# EAGLE design Wozblaster_v1.2 (EAGLE 6.5.0)
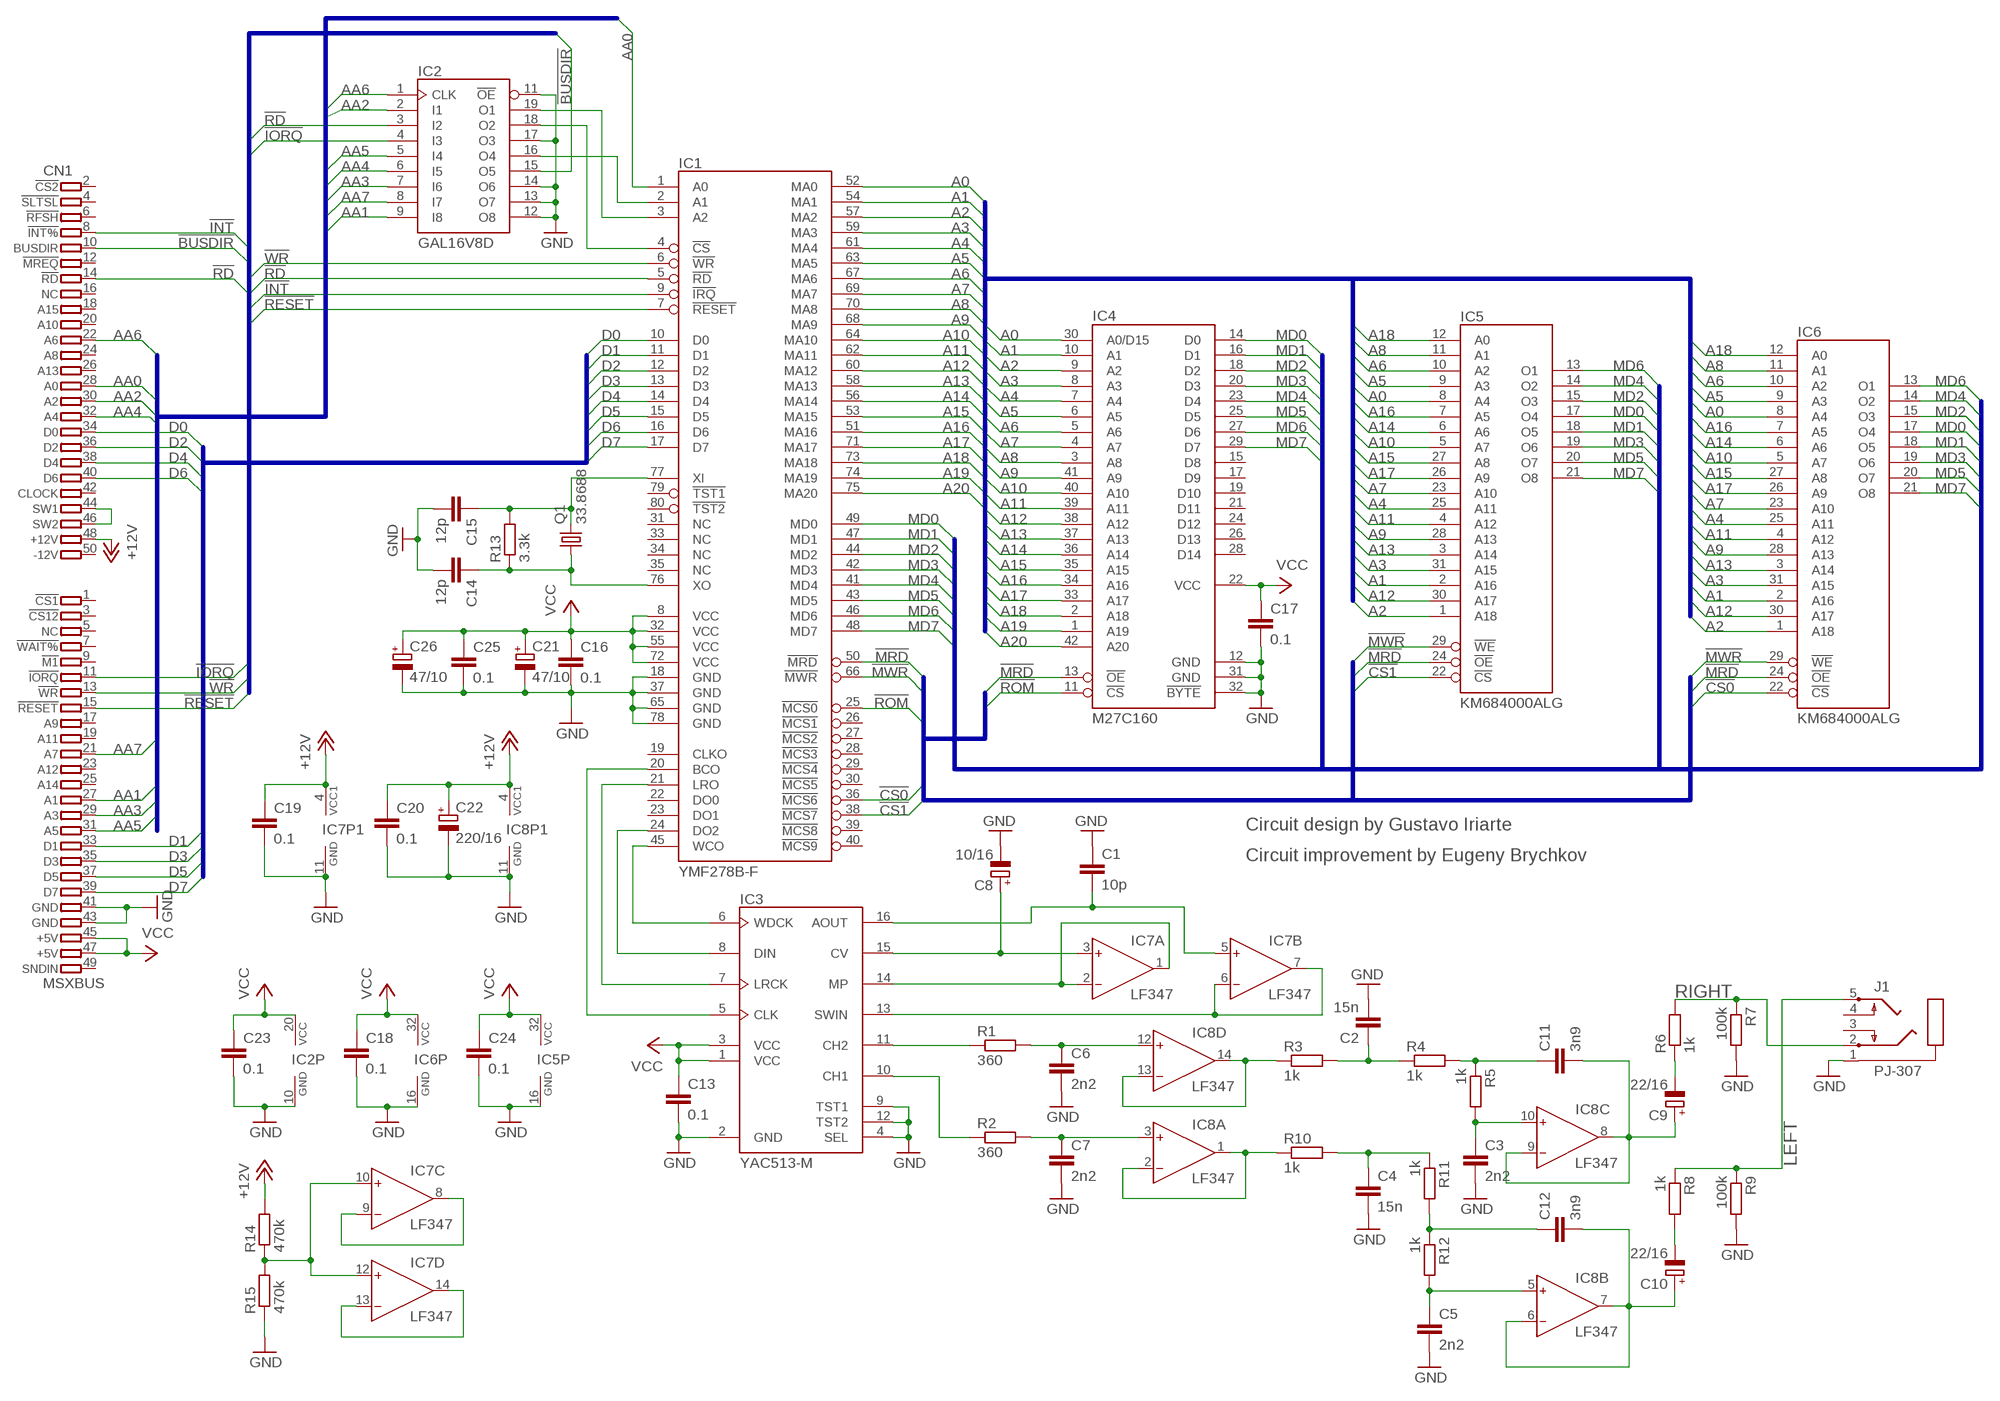
[diagram p0: schematic, sheet 1]

## Parts
C1  10p  C-EU  [C0805]
C2  15n  C-EU  [C0805]
C3  2n2  C-EU  [C0805]
C4  15n  C-EU  [C0805]
C5  2n2  C-EU  [C0805]
C6  2n2  C-EU  [C0805]
C7  2n2  C-EU  [C0805]
C8  10/16  CPOLSMCB  [SMC_B]
C9  22/16  CPOLSMCB  [SMC_B]
C10  22/16  CPOLSMCB  [SMC_B]
C11  3n9  C-EU  [C0805]
C12  3n9  C-EU  [C0805]
C13  0.1  C-EU  [C0805]
C14  12p  C-EU  [C0805]
C15  12p  C-EU  [C0805]
C16  0.1  C-EU  [C0805]
C17  0.1  C-EU  [C0805]
C18  0.1  C-EU  [C0805]
C19  0.1  C-EU  [C0805]
C20  0.1  C-EU  [C0805]
C21  47/10  CPOLSMCB  [SMC_B]
C22  220/16  CPOLSMCE  [SMC_E]
C23  0.1  C-EU  [C0805]
C24  0.1  C-EU  [C0805]
C25  0.1  C-EU  [C0805]
C26  47/10  CPOLSMCB  [SMC_B]
CN1  MSXBUS  MSXBUS_EDGE  [MSXBUS_EDGECONN]
IC1  YMF278B-F  [80-QFP]
IC2  GAL16V8D  GAL16V8P3  [DIL20]
IC3  YAC513-M  [16SOP]
IC4  M27C160  [DIL42]
IC5  KM684000ALG  SRAM4MBIT  [SOP32L]
IC6  KM684000ALG  SRAM4MBIT  [SOP32L]
IC7  LF347  LF347SO14  [SO14-2]
IC8  LF347  LF347SO14  [SO14-2]
J1  PJ-307  [PJ-307]
Q1  33.8688  CRYSTALHC49S  [HC49/S]
R1  360  R-EU  [R0805]
R2  360  R-EU  [R0805]
R3  1k  R-EU  [R0805]
R4  1k  R-EU  [R0805]
R5  1k  R-EU  [R0805]
R6  1k  R-EU  [R0805]
R7  100k  R-EU  [R0805]
R8  1k  R-EU  [R0805]
R9  100k  R-EU  [R0805]
R10  1k  R-EU  [R0805]
R11  1k  R-EU  [R0805]
R12  1k  R-EU  [R0805]
R13  3.3k  R-EU  [R0805]
R14  470k  R-EU  [R0805]
R15  470k  R-EU  [R0805]

## Nets
!BUSDIR: CN1.10(10.BUSDIR) IC2.15(O5)
!CS0: IC1.36(!MCS6) IC6.22(!CS)
!CS1: IC1.38(!MCS7) IC5.22(!CS)
!INT: CN1.8(8.!INT%) IC1.9(!IRQ)
!IORQ: CN1.11(11.!IORQ) IC2.4(I3)
!MRD: IC1.50(!MRD) IC4.13(!OE) IC5.24(!OE) IC6.24(!OE)
!MWR: IC1.66(!MWR) IC5.29(!WE) IC6.29(!WE)
!RD: CN1.14(14.!RD) IC1.5(!RD) IC2.3(I2)
!RESET: CN1.15(15.!RESET) IC1.7(!RESET)
!ROM: IC1.25(!MCS0) IC4.11(!CS)
!WR: CN1.13(13.!WR) IC1.6(!WR)
+12V: C19.1 C20.1 C22.+ CN1.48(48.+12V) IC7.4(P1:VCC) IC8.4(P1:VCC) R14.2
A0: IC1.52(MA0) IC4.30(A0/D15) IC5.8(A4) IC6.8(A4)
A1: IC1.54(MA1) IC4.10(A1) IC5.2(A16) IC6.2(A16)
A2: IC1.57(MA2) IC4.9(A2) IC5.1(A18) IC6.1(A18)
A3: IC1.59(MA3) IC4.8(A3) IC5.31(A15) IC6.31(A15)
A4: IC1.61(MA4) IC4.7(A4) IC5.25(A11) IC6.25(A11)
A5: IC1.63(MA5) IC4.6(A5) IC5.9(A3) IC6.9(A3)
A6: IC1.67(MA6) IC4.5(A6) IC5.10(A2) IC6.10(A2)
A7: IC1.69(MA7) IC4.4(A7) IC5.23(A10) IC6.23(A10)
A8: IC1.70(MA8) IC4.3(A8) IC5.11(A1) IC6.11(A1)
A9: IC1.68(MA9) IC4.41(A9) IC5.28(A13) IC6.28(A13)
A10: IC1.64(MA10) IC4.40(A10) IC5.5(A7) IC6.5(A7)
A11: IC1.62(MA11) IC4.39(A11) IC5.4(A12) IC6.4(A12)
A12: IC1.60(MA12) IC4.38(A12) IC5.30(A17) IC6.30(A17)
A13: IC1.58(MA13) IC4.37(A13) IC5.3(A14) IC6.3(A14)
A14: IC1.56(MA14) IC4.36(A14) IC5.6(A6) IC6.6(A6)
A15: IC1.53(MA15) IC4.35(A15) IC5.27(A8) IC6.27(A8)
A16: IC1.51(MA16) IC4.34(A16) IC5.7(A5) IC6.7(A5)
A17: IC1.71(MA17) IC4.33(A17) IC5.26(A9) IC6.26(A9)
A18: IC1.73(MA18) IC4.2(A18) IC5.12(A0) IC6.12(A0)
A19: IC1.74(MA19) IC4.1(A19)
A20: IC1.75(MA20) IC4.42(A20)
AA0: CN1.28(28.A0) IC1.1(A0)
AA1: CN1.27(27.A1) IC2.9(I8)
AA2: CN1.30(30.A2) IC2.2(I1)
AA3: CN1.29(29.A3) IC2.7(I6)
AA4: CN1.32(32.A4) IC2.6(I5)
AA5: CN1.31(31.A5) IC2.5(I4)
AA6: CN1.22(22.A6) IC2.1(CLK)
AA7: CN1.21(21.A7) IC2.8(I7)
D0: CN1.34(34.D0) IC1.10(D0)
D1: CN1.33(33.D1) IC1.11(D1)
D2: CN1.36(36.D2) IC1.12(D2)
D3: CN1.35(35.D3) IC1.13(D3)
D4: CN1.38(38.D4) IC1.14(D4)
D5: CN1.37(37.D5) IC1.15(D5)
D6: CN1.40(40.D6) IC1.16(D6)
D7: CN1.39(39.D7) IC1.17(D7)
GND: C1.1 C2.2 C3.2 C4.2 C5.2 C6.2 C7.2 C8.- C13.2 C14.2 C15.2 C16.2 C17.2 C18.2 C19.2 C20.2 C21.- C22.- C23.2 C24.2 C25.2 C26.- CN1.41(41.GND) CN1.43(43.GND) IC1.18(GND) IC1.37(GND) IC1.65(GND) IC1.78(GND) IC2.10(GND) IC2.11(!OE) IC2.12(O8) IC2.13(O7) IC2.14(O6) IC2.17(O3) IC3.2(GND) IC3.4(SEL) IC3.9(TST1) IC3.12(TST2) IC4.12(GND) IC4.31(GND) IC4.32(!BYTE) IC5.16(GND) IC6.16(GND) IC7.11(P1:GND) IC8.11(P1:GND) J1.1 R7.2 R9.2 R15.1
MD0: IC1.49(MD0) IC4.14(D0) IC5.17(O4) IC6.17(O4)
MD1: IC1.47(MD1) IC4.16(D1) IC5.18(O5) IC6.18(O5)
MD2: IC1.44(MD2) IC4.18(D2) IC5.15(O3) IC6.15(O3)
MD3: IC1.42(MD3) IC4.20(D3) IC5.19(O6) IC6.19(O6)
MD4: IC1.41(MD4) IC4.23(D4) IC5.14(O2) IC6.14(O2)
MD5: IC1.43(MD5) IC4.25(D5) IC5.20(O7) IC6.20(O7)
MD6: IC1.46(MD6) IC4.27(D6) IC5.13(O1) IC6.13(O1)
MD7: IC1.48(MD7) IC4.29(D7) IC5.21(O8) IC6.21(O8)
N$2: C5.1 IC8.5(B:IN+) R12.2
N$4: CN1.44(44.SW1) CN1.46(46.SW2)
N$5: IC7.10(C:IN+) IC7.12(D:IN+) R14.1 R15.2
N$6: IC7.8(C:OUT) IC7.9(C:IN-)
N$7: IC7.13(D:IN-) IC7.14(D:OUT)
N$11: IC1.3(A2) IC2.19(O1)
N$12: IC1.4(!CS) IC2.18(O2)
N$13: IC1.2(A1) IC2.16(O4)
N$15: C1.2 IC3.16(AOUT) IC7.5(B:IN+)
N$16: IC3.14(MP) IC7.1(A:OUT) IC7.2(A:IN-)
N$17: IC3.11(CH2) R1.1
N$18: C6.1 IC8.12(D:IN+) R1.2
N$19: IC8.13(D:IN-) IC8.14(D:OUT) R3.1
N$20: C2.1 R3.2 R4.1
N$21: C11.1 R4.2 R5.1
N$22: C3.1 IC8.10(C:IN+) R5.2
N$23: C9.+ C11.2 IC8.8(C:OUT) IC8.9(C:IN-)
N$24: C10.- R8.2
N$25: J1.2 R6.2 R7.1
N$26: C7.1 IC8.3(A:IN+) R2.2
N$27: IC8.1(A:OUT) IC8.2(A:IN-) R10.1
N$28: C4.1 R10.2 R11.1
N$29: C12.1 R11.2 R12.1
N$31: C10.+ C12.2 IC8.6(B:IN-) IC8.7(B:OUT)
N$32: C9.- R6.1
N$33: J1.5 R8.1 R9.1
N$34: IC3.10(CH1) R2.1
N$35: C8.+ IC3.15(CV) IC7.3(A:IN+)
N$36: IC3.13(SWIN) IC7.6(B:IN-) IC7.7(B:OUT)
N$37: IC1.20(BCO) IC3.5(CLK)
N$38: IC1.45(WCO) IC3.6(WDCK)
N$39: IC1.21(LRO) IC3.7(LRCK)
N$40: IC1.24(DO2) IC3.8(DIN)
N$41: C15.1 IC1.77(XI) Q1.2 R13.2
N$42: C14.1 IC1.76(XO) Q1.1 R13.1
VCC: C13.1 C16.1 C17.1 C18.1 C21.+ C23.1 C24.1 C25.1 C26.+ CN1.45(45.+5V) CN1.47(47.+5V) IC1.8(VCC) IC1.32(VCC) IC1.55(VCC) IC1.72(VCC) IC2.20(VCC) IC3.1(VCC) IC3.3(VCC) IC4.22(VCC) IC5.32(VCC) IC6.32(VCC)
Unconnected: CN1.1(1.!CS1) CN1.2(2.!CS2) CN1.3(3.!CS12) CN1.4(4.!SLTSL) CN1.5(5.NC) CN1.6(6.!RFSH) CN1.7(7.!WAIT%) CN1.9(9.!M1) CN1.12(12.!MREQ) CN1.16(16.NC) CN1.17(17.A9) CN1.18(18.A15) CN1.19(19.A11) CN1.20(20.A10) CN1.23(23.A12) CN1.24(24.A8) CN1.25(25.A14) CN1.26(26.A13) CN1.42(42.CLOCK) CN1.49(49.SNDIN) CN1.50(50.-12V) IC1.19(CLKO) IC1.22(DO0) IC1.23(DO1) IC1.26(!MCS1) IC1.27(!MCS2) IC1.28(!MCS3) IC1.29(!MCS4) IC1.30(!MCS5) IC1.31(NC) IC1.33(NC) IC1.34(NC) IC1.35(NC) IC1.39(!MCS8) IC1.40(!MCS9) IC1.79(!TST1) IC1.80(!TST2) IC4.15(D8) IC4.17(D9) IC4.19(D10) IC4.21(D11) IC4.24(D12) IC4.26(D13) IC4.28(D14) J1.3 J1.4

## Buses
A[0..20]
MD[0..7]
AA[0..15]
D[0..7]
!IORQ,!RD,!WR,!RESET,!INT,!BUSDIR
!MRD,!MWR,!ROM,!CS0,!CS1

## Notes on the sheet
- Circuit design by Gustavo Iriarte
- Circuit improvement by Eugeny Brychkov
- RIGHT
- LEFT

## Library data of the parts
C1-C7 C11-C20 C23-C25 = wozblaster:C-EU: Capacitor, SMD
C8-C10 C21 C22 C26 = wozblaster:CPOL: Capacitor, polarized, tantalum
CN1 = msx_breadboards:MSXBUS_EDGE: MSX bus (50 pin) edge connector Created 2013 by Eugeny Brychkov
IC1 = wozblaster:YMF278B-F: OPL4 Amended by Eugeny Brychkov
IC2 = wozblaster:GAL16V8: High perfomance CMOS (electrically erasable) programmable logic device (PLD) GAL16V8/ATF16V8B
IC3 = wozblaster:YAC513-M: YAC513 2-channel floating D/A converter
IC4 = wozblaster:M27C160: Dual In Line
IC5 IC6 = wozblaster:SRAM4MBIT: SRAM 4 Mbit Designed by Gustavo Iriarte Compiled by Eugeny Brychkov
IC7 IC8 = wozblaster:LF347SO14: LF347 JFET input quad operational amplifiers
J1 = wozblaster:PJ-307: 2.5mm jack to connect headphones to
Q1 = crystal:CRYSTAL: CRYSTAL; OC_FARNELL: 1667008; OC_NEWARK: unknown
R1-R15 = wozblaster:R-EU: Resistor, SMD

## Board
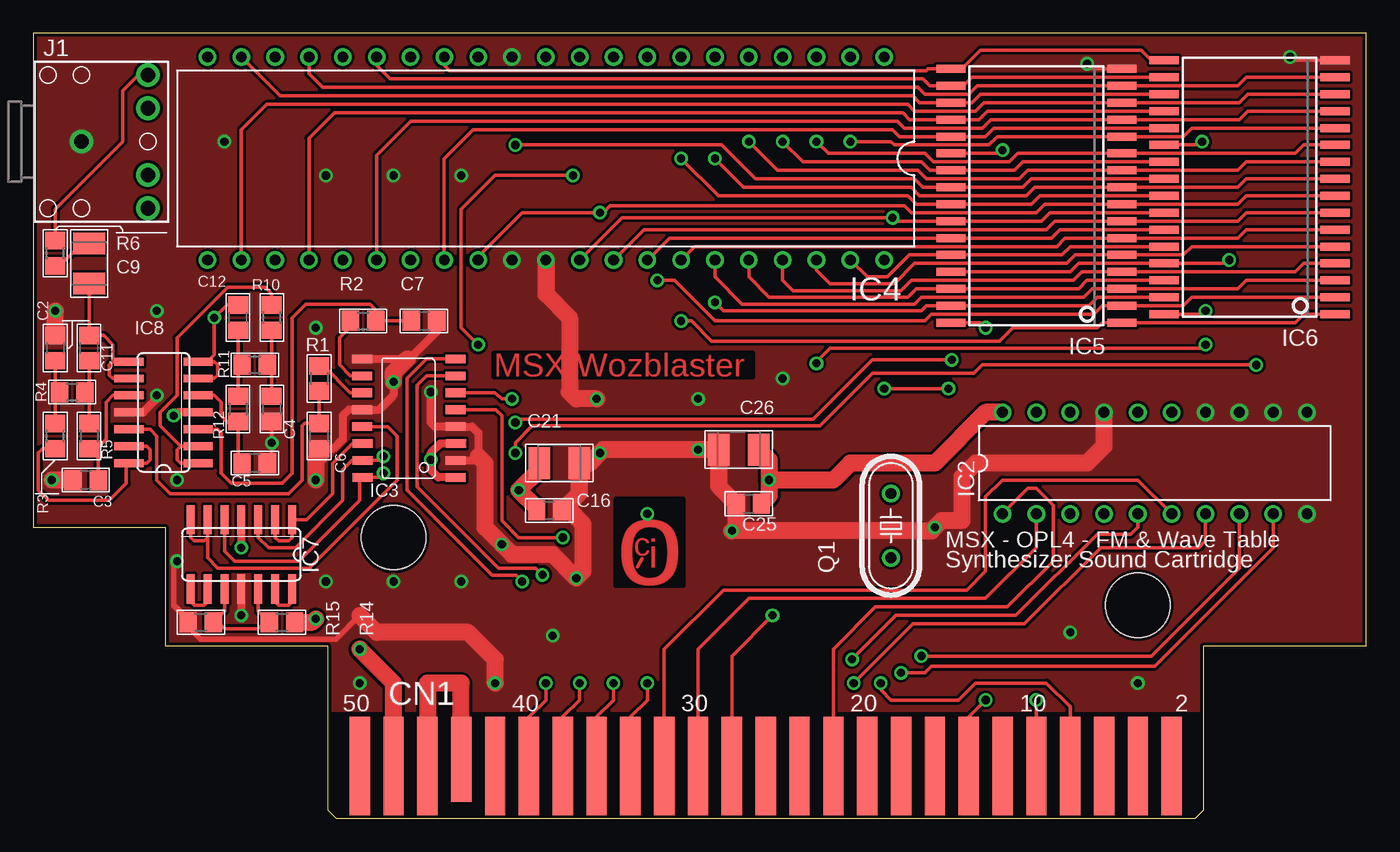
[diagram p1: board, top side]
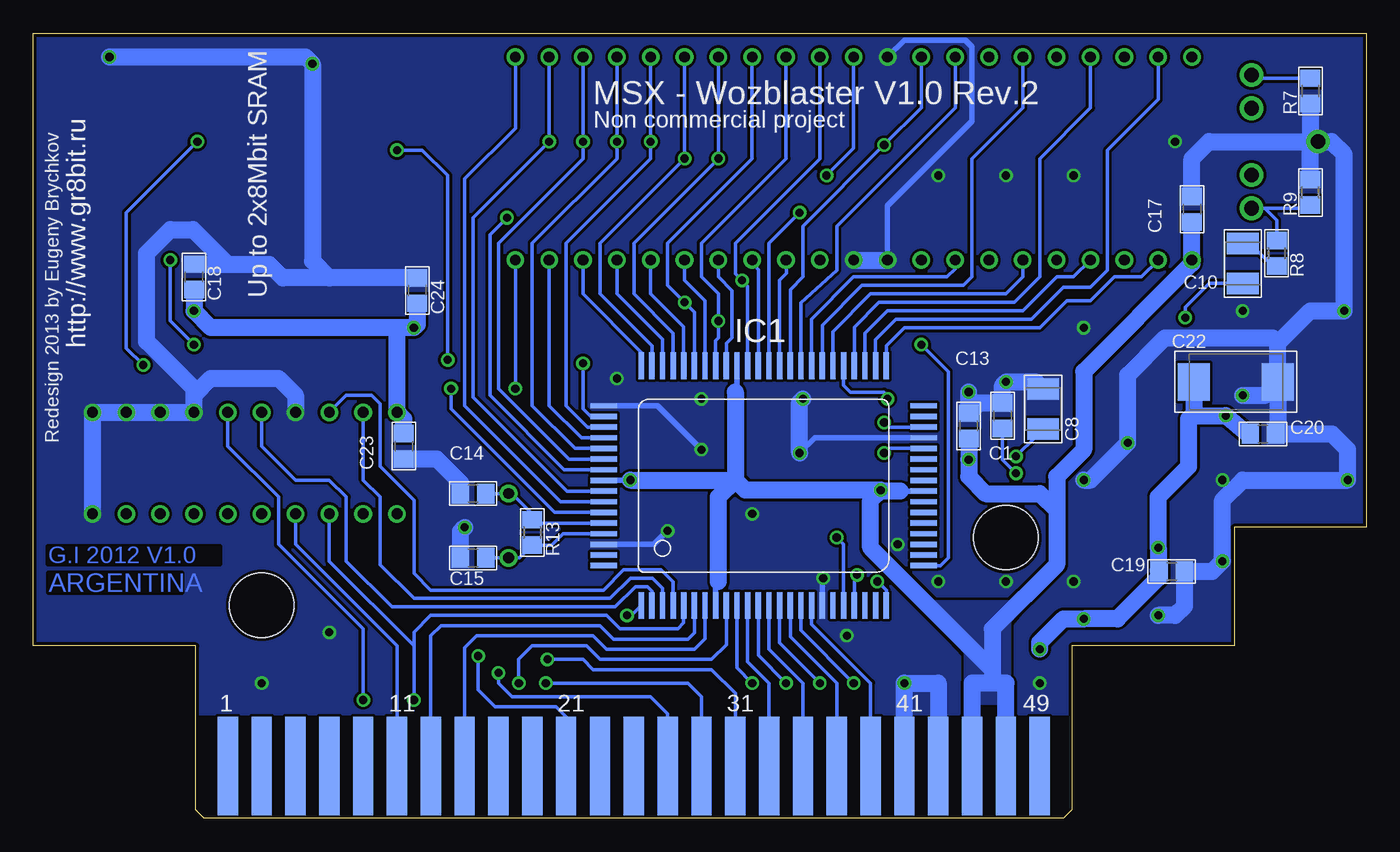
[diagram p2: board, bottom side, seen from below]

Size 100.08 x 58.93 mm. Coordinates in mm from the lower left corner, seen from the top.
Outline: 87.88,12.95 100.08,12.95 100.08,58.93 0,58.93 0,21.84 9.91,21.84 9.91,12.95 22.1,12.95
Copper layers (1*16): Top 0.035mm / dielectric 1.5mm / Bottom 0.035mm
Design rules "default *": minimum track width 10mil, minimum drill 24mil, track to track 8mil, track to pad 8mil, pad to pad 8mil, via to via 8mil, smd to smd 8mil, copper to edge 10mil, drill to drill 8mil, minimum pad ring 10mil, minimum via ring 8mil, stop-mask expansion 4mil, vias tented up to drill 0mil, thermal gap 20mil

### Footprints (pad centres in the part's own frame; a part is rotated, then mirrored left to right if it is on the bottom)
C0805 = smd 1.3 x 1.5: 1 -0.95,0; 2 0.95,0
SMC_B = smd 1.6 x 2.4: + -1.5,0; - 1.5,0
SMC_E = smd 2.4 x 2.8: + -3.15,0; - 3.15,0
MSXBUS_EDGECONN = smd 1.524 x 7.366 bottom: 1 30.48,3.937; 3 27.94,3.937; 5 25.4,3.937; 7 22.86,3.937; 9 20.32,3.937; 11 17.78,3.937; 13 15.24,3.937; 15 12.7,3.937; 17 10.16,3.937; 19 7.62,3.937; 21 5.08,3.937; 23 2.54,3.937; 25 0,3.937; 27 -2.54,3.937; 29 -5.08,3.937; 31 -7.62,3.937; 33 -10.16,3.937; 35 -12.7,3.937; 37 -15.24,3.937; 39 -17.78,3.937; 41 -20.32,3.937; 43 -22.86,3.937; 45 -25.4,3.937; 47 -27.94,3.937; 49 -30.48,3.937 | smd 1.524 x 7.366: 2 30.48,3.937; 4 27.94,3.937; 6 25.4,3.937; 8 22.86,3.937; 10 20.32,3.937; 12 17.78,3.937; 14 15.24,3.937; 16 12.7,3.937; 18 10.16,3.937; 20 7.62,3.937; 22 5.08,3.937; 24 2.54,3.937; 26 0,3.937; 28 -2.54,3.937; 30 -5.08,3.937; 32 -7.62,3.937; 34 -10.16,3.937; 36 -12.7,3.937; 38 -15.24,3.937; 40 -17.78,3.937; 42 -20.32,3.937; 46 -25.4,3.937; 48 -27.94,3.937; 50 -30.48,3.937 | smd 1.524 x 6.35: 44 -22.86,4.445 | hole 4.826: -27.94,21.082; 27.94,16.002
80-QFP = smd 0.4 x 2: 1 -9.1,-9.3; 2 -8.3,-9.3; 3 -7.5,-9.3; 4 -6.7,-9.3; 5 -5.9,-9.3; 6 -5.1,-9.3; 7 -4.3,-9.3; 8 -3.5,-9.3; 9 -2.7,-9.3; 10 -1.9,-9.3; 11 -1.1,-9.3; 12 -0.3,-9.3; 13 0.5,-9.3; 14 1.3,-9.3; 15 2.1,-9.3; 16 2.9,-9.3; 17 3.7,-9.3; 18 4.5,-9.3; 19 5.3,-9.3; 20 6.1,-9.3; 21 6.9,-9.3; 22 7.7,-9.3; 23 8.5,-9.3; 24 9.3,-9.3; 41 9.3,8.7; 42 8.5,8.7; 43 7.7,8.7; 44 6.9,8.7; 45 6.1,8.7; 46 5.3,8.7; 47 4.5,8.7; 48 3.7,8.7; 49 2.9,8.7; 50 2.1,8.7; 51 1.3,8.7; 52 0.5,8.7; 53 -0.3,8.7; 54 -1.1,8.7; 55 -1.9,8.7; 56 -2.7,8.7; 57 -3.5,8.7; 58 -4.3,8.7; 59 -5.1,8.7; 60 -5.9,8.7; 61 -6.7,8.7; 62 -7.5,8.7; 63 -8.3,8.7; 64 -9.1,8.7 | smd 2 x 0.4: 25 12.1,-6.3; 26 12.1,-5.5; 27 12.1,-4.7; 28 12.1,-3.9; 29 12.1,-3.1; 30 12.1,-2.3; 31 12.1,-1.5; 32 12.1,-0.7; 33 12.1,0.1; 34 12.1,0.9; 35 12.1,1.7; 36 12.1,2.5; 37 12.1,3.3; 38 12.1,4.1; 39 12.1,4.9; 40 12.1,5.7; 65 -11.9,5.7; 66 -11.9,4.9; 67 -11.9,4.1; 68 -11.9,3.3; 69 -11.9,2.5; 70 -11.9,1.7; 71 -11.9,0.9; 72 -11.9,0.1; 73 -11.9,-0.7; 74 -11.9,-1.5; 75 -11.9,-2.3; 76 -11.9,-3.1; 77 -11.9,-3.9; 78 -11.9,-4.7; 79 -11.9,-5.5; 80 -11.9,-6.3
DIL20 = drill 0.813: 1 -11.43,-3.81; 2 -8.89,-3.81; 3 -6.35,-3.81; 4 -3.81,-3.81; 5 -1.27,-3.81; 6 1.27,-3.81; 7 3.81,-3.81; 8 6.35,-3.81; 9 8.89,-3.81; 10 11.43,-3.81; 11 11.43,3.81; 12 8.89,3.81; 13 6.35,3.81; 14 3.81,3.81; 15 1.27,3.81; 16 -1.27,3.81; 17 -3.81,3.81; 18 -6.35,3.81; 19 -8.89,3.81; 20 -11.43,3.81
16SOP = smd 0.65 x 1.5: 1 -3.61,-3.4; 2 -2.34,-3.4; 3 -1.07,-3.41; 4 0.2,-3.4; 5 1.47,-3.4; 6 2.74,-3.4; 7 4.01,-3.39; 8 5.28,-3.39; 9 5.28,3.63; 10 4.01,3.63; 11 2.74,3.62; 12 1.47,3.62; 13 0.2,3.62; 14 -1.07,3.61; 15 -2.34,3.61; 16 -3.61,3.61
DIL42 = drill 0.813: 1 -25.4,-7.62; 2 -22.86,-7.62; 3 -20.32,-7.62; 4 -17.78,-7.62; 5 -15.24,-7.62; 6 -12.7,-7.62; 7 -10.16,-7.62; 8 -7.62,-7.62; 9 -5.08,-7.62; 10 -2.54,-7.62; 11 0,-7.62; 12 2.54,-7.62; 13 5.08,-7.62; 14 7.62,-7.62; 15 10.16,-7.62; 16 12.7,-7.62; 17 15.24,-7.62; 18 17.78,-7.62; 19 20.32,-7.62; 20 22.86,-7.62; 21 25.4,-7.62; 22 25.4,7.62; 23 22.86,7.62; 24 20.32,7.62; 25 17.78,7.62; 26 15.24,7.62; 27 12.7,7.62; 28 10.16,7.62; 29 7.62,7.62; 30 5.08,7.62; 31 2.54,7.62; 32 0,7.62; 33 -2.54,7.62; 34 -5.08,7.62; 35 -7.62,7.62; 36 -10.16,7.62; 37 -12.7,7.62; 38 -15.24,7.62; 39 -17.78,7.62; 40 -20.32,7.62; 41 -22.86,7.62; 42 -25.4,7.62
SOP32L = smd 0.6 x 2.2: 1 -9.525,-6.416; 2 -8.255,-6.416; 3 -6.985,-6.416; 4 -5.715,-6.416; 5 -4.445,-6.416; 6 -3.175,-6.416; 7 -1.905,-6.416; 8 -0.635,-6.416; 9 0.635,-6.416; 10 1.905,-6.416; 11 3.175,-6.416; 12 4.445,-6.416; 13 5.715,-6.416; 14 6.985,-6.416; 15 8.255,-6.416; 16 9.525,-6.416; 17 9.525,6.416; 18 8.255,6.416; 19 6.985,6.416; 20 5.715,6.416; 21 4.445,6.416; 22 3.175,6.416; 23 1.905,6.416; 24 0.635,6.416; 25 -0.635,6.416; 26 -1.905,6.416; 27 -3.175,6.416; 28 -4.445,6.416; 29 -5.715,6.416; 30 -6.985,6.416; 31 -8.255,6.416; 32 -9.525,6.416
SO14-2 = smd 0.6 x 2.2: 1 -3.81,-2.6; 2 -2.54,-2.6; 3 -1.27,-2.6; 4 0,-2.6; 5 1.27,-2.6; 6 2.54,-2.6; 7 3.81,-2.6; 8 3.81,2.6; 9 2.54,2.6; 10 1.27,2.6; 11 0,2.6; 12 -1.27,2.6; 13 -2.54,2.6; 14 -3.81,2.6
PJ-307 = drill 1.1 pad 1.778: 1 0,-4.5; 2 5,-9.5; 3 2.5,-9.5; 4 -2.5,-9.5; 5 -5,-9.5
HC49/S = drill 0.813: 1 -2.413,0; 2 2.413,0
R0805 = smd 1.3 x 1.5: 1 -0.95,0; 2 0.95,0

### Placement (x,y rotation side)
C1  27.3,30.23 270 bottom
C2  1.65,35.31 90 top
C3  3.94,25.4 180 top
C4  17.91,30.73 270 top
C5  16.64,26.67 0 top
C6  21.46,28.7 270 top
C7  29.34,37.34 0 top
C8  24.26,30.73 90 bottom
C9  4.19,41.66 90 top
C10  9.27,41.66 90 bottom
C11  4.19,35.31 90 top
C12  15.37,37.59 90 top
C13  29.84,29.46 90 bottom
C14  67.06,24.38 180 bottom
C15  67.06,19.56 180 bottom
C16  38.73,23.11 0 top
C17  13.08,45.72 90 bottom
C18  88.01,40.64 90 bottom
C19  14.6,18.54 0 bottom
C20  7.75,28.86 0 bottom
C21  39.5,26.67 0 top
C22  9.78,32.77 0 bottom
C23  72.26,27.94 270 bottom
C24  71.25,39.62 90 bottom
C25  53.72,23.62 180 top
C26  52.96,27.69 180 top
CN1  54.99,0 0 top
IC1  45.34,25.27 0 bottom
IC2  84.2,26.67 0 top
IC3  28.32,29.21 90 top
IC4  38.48,49.53 180 top
IC5  75.31,46.74 90 top
IC6  91.31,47.37 90 top
IC7  15.62,19.81 180 top
IC8  9.78,30.48 90 top
J1  -0.89,50.8 90 top
Q1  64.39,21.97 270 top
R1  21.46,33.02 270 top
R2  24.77,37.34 0 top
R3  1.65,28.7 90 top
R4  2.92,32 0 top
R5  4.19,28.7 270 top
R6  1.65,42.42 90 top
R7  4.19,54.61 270 bottom
R8  6.73,42.42 270 bottom
R9  4.19,46.99 90 bottom
R10  17.91,37.59 270 top
R11  16.64,34.04 180 top
R12  15.37,30.73 270 top
R13  62.61,21.46 270 bottom
R14  18.67,14.73 0 top
R15  12.57,14.73 0 top

### Tracks (layer width: path | path; a pad name or v marks a point on that pad's centre or on a via)
!BUSDIR  (via drill 0.61)
  Top 0.254: CN1.10 v75.31,8.89
  Bottom 0.254: v75.31,8.89 75.31,14.22 81.66,20.57 81.66,24.13 85.47,27.94 IC2.15
!CS0  (via drill 0.61)
  Top 0.254: IC6.22 87.5,50.55 v87.76,50.8 | v91.82,34.04 71.25,34.04 70.61,33.4 62.99,33.4 59.05,29.46 37.47,29.46 36.2,28.19 v36.2,27.43
  Bottom 0.254: v87.76,50.8 93.09,45.47 93.09,35.31 v91.82,34.04 | IC1.36 35.85,27.77 v36.2,27.43
!CS1  (via drill 0.61)
  Top 0.254: IC5.22 72.52,49.91 v72.77,50.16 | v68.96,34.42 62.99,34.42 58.55,29.97 36.45,29.97 v36.2,29.72
  Bottom 0.254: v72.77,50.16 70.87,50.16 68.96,48.26 v68.96,34.42 | IC1.38 35.85,29.37 v36.2,29.72
!INT  (via drill 0.61)
  Top 0.254: CN1.8 77.85,8.38 76.07,10.16 70.74,10.16 69.47,8.89 64.39,8.89 63.63,9.65 v63.63,10.16
  Bottom 0.254: IC1.9 48.04,13.05 49.15,11.94 57.53,11.94 58.55,12.95 62.61,12.95 63.63,11.94 v63.63,10.16
!IORQ
  Bottom 0.254: CN1.11 72.77,12.95 80.39,20.57 IC2.4
!MRD  (via drill 0.61)
  Top 0.254: IC6.24 74.93,48.01 74.3,47.37 IC5.24 66.8,47.37 66.17,48.01 54.23,48.01 51.69,50.55 v36.2,50.55
  Bottom 0.254: IC1.50 43.24,39.69 42.29,40.64 42.29,44.45 v36.2,50.55 33.4,53.34 IC4.13
!MWR  (via drill 0.61)
  Top 0.254: IC5.29 77.85,41.02 78.49,41.66 IC6.29 89.28,41.66 v89.79,41.91 | v58.8,34.16 58.8,34.29 59.82,35.31 87.76,35.31 v88.01,35.56
  Bottom 0.254: IC1.66 58.24,30.17 58.8,30.73 v58.8,34.16 | v89.79,41.91 89.79,37.34 v88.01,35.56
!RD  (via drill 0.61)
  Top 0.254: CN1.14 70.23,7.62 v71.5,8.89
  Bottom 0.254: IC2.3 77.85,19.3 71.5,12.95 | 71.5,12.95 v71.5,8.89 | IC1.5 51.24,14.67 51.69,14.22 56.01,14.22 57.02,15.24 70.23,15.24 71.5,13.97 71.5,12.95
!RESET
  Bottom 0.254: CN1.15 67.69,12.83 66.8,13.72 58.04,13.72 57.02,12.7 50.42,12.7 49.64,13.48 IC1.7
!ROM  (via drill 0.61)
  Top 0.254: v40.51,48.26 34.67,48.26 32.13,45.72 32.13,36.83 v33.4,35.56
  Bottom 0.254: IC1.25 31.95,18.97 31.37,19.56 31.37,33.53 v33.4,35.56 | IC4.11 38.48,50.29 v40.51,48.26
!WR
  Bottom 0.254: CN1.13 70.23,13.72 69.47,14.48 57.53,14.48 56.52,13.46 50.93,13.46 50.44,13.95 IC1.6
+12V  (via drill 0.61)
  Top 0.61: IC8.4 10.8,30.48 v10.54,30.23 | IC7.4 v15.62,20.32
  Top 1.27: CN1.48 27.05,10.16 v24.51,12.7 | R14.2 20.95,14.73 v21.21,14.99
  Bottom 1.27: v24.51,12.7 24.51,13.21 22.73,14.99 v21.21,14.99 18.67,14.99 15.55,18.1 C19.1 15.62,18.61 v15.62,20.32 15.62,24.13 13.34,26.42 13.34,29.97 13.08,30.23 | C22.+ 12.93,30.38 13.08,30.23 | 13.08,30.23 v10.54,30.23 8.92,28.86 C20.1
A0  (via drill 0.61)
  Top 0.254: IC4.30 33.4,42.16 36.7,45.47 v42.55,45.47 42.8,45.47 43.31,45.97 65.41,45.97 65.91,45.47 75.31,45.47 75.95,46.1 IC5.8 90.42,46.1 91.06,46.74 IC6.8
  Bottom 0.254: IC1.52 44.84,40.39 44.83,40.89 44.83,43.18 v42.55,45.47
A1  (via drill 0.61)
  Top 0.254: v46.86,40.39 48.13,40.39 51.18,37.34 66.93,37.34 67.44,37.85 79.63,37.85 80.26,38.48 IC5.2 86.36,38.48 87,39.12 IC6.2
  Bottom 0.254: IC4.10 41.02,49.53 47.37,43.18 47.37,40.89 v46.86,40.39 46.44,39.96 IC1.54
A2  (via drill 0.61)
  Top 0.254: IC6.1 95.38,37.85 94.74,37.21 IC5.1 80.26,37.21 79.88,36.83 73.53,36.83 72.52,35.81 50.93,35.81 49.4,37.34 v48.64,37.34
  Bottom 0.254: IC1.57 48.84,35.87 48.64,36.07 v48.64,37.34 48.64,39.37 49.91,40.64 49.91,43.18 43.56,49.53 IC4.9
A3  (via drill 0.61)
  Top 0.254: v51.18,38.73 51.82,38.1 66.67,38.1 67.06,38.48 IC5.31 79.25,38.48 79.88,39.12 IC6.31
  Bottom 0.254: IC1.59 50.44,37.99 v51.18,38.73 52.45,40.01 52.45,43.18 46.1,49.53 IC4.8
A4  (via drill 0.61)
  Top 0.254: v48.64,49.53 51.44,46.74 65.66,46.74 66.29,46.1 IC5.25 74.93,46.1 75.56,46.74 IC6.25
  Bottom 0.254: IC1.61 52.04,36.42 54.99,39.37 54.99,43.18 v48.64,49.53 IC4.7
A5  (via drill 0.61)
  Top 0.254: v51.18,49.53 53.34,47.37 65.91,47.37 66.55,46.74 74.55,46.74 75.18,47.37 IC5.9 90.42,47.37 91.06,48.01 IC6.9
  Bottom 0.254: IC1.63 53.64,35.48 57.53,39.37 57.53,43.18 v51.18,49.53 IC4.6
A6  (via drill 0.61)
  Top 0.254: v53.72,50.8 55.88,48.64 66.42,48.64 67.06,48.01 74.04,48.01 74.68,48.64 IC5.10 90.42,48.64 91.06,49.28 IC6.10
  Bottom 0.254: IC4.5 v53.72,50.8 53.72,49.53 60.07,43.18 60.07,30.99 58.46,29.37 IC1.67
A7  (via drill 0.61)
  Top 0.254: v56.26,50.8 57.78,49.28 66.67,49.28 67.31,48.64 IC5.23 73.66,48.64 74.3,49.28 IC6.23
  Bottom 0.254: IC4.4 v56.26,50.8 56.26,49.53 62.61,43.18 62.61,30.99 59.4,27.77 IC1.69
A8  (via drill 0.61)
  Top 0.254: v58.8,50.8 59.69,49.91 66.93,49.91 67.56,49.28 73.28,49.28 73.91,49.91 IC5.11 94.74,49.91 95.38,50.55 IC6.11
  Bottom 0.254: IC4.3 v58.8,50.8 58.8,49.53 65.15,43.18 65.15,32.26 59.87,26.97 IC1.70
A9
  Top 0.254: IC4.41 62.61,40.64 64.14,40.64 65.79,42.29 IC5.28 77.22,42.29 77.85,42.93 IC6.28
  Bottom 0.254: IC4.41 61.34,30.99 58.93,28.57 IC1.68
A10
  Top 0.254: IC4.40 58.8,41.15 59.82,40.13 64.64,40.13 66.17,41.66 77.6,41.66 78.23,42.29 IC5.5 86.36,42.29 87,42.93 IC6.5
  Bottom 0.254: IC1.64 54.44,35.01 58.8,39.37 IC4.40
A11
  Top 0.254: IC4.39 56.26,40.39 57.02,39.62 65.15,39.62 65.91,40.39 78.11,40.39 78.74,41.02 IC5.4 94.74,41.02 95.38,41.66 IC6.4
  Bottom 0.254: IC1.62 52.84,35.95 56.26,39.37 IC4.39
A12
  Top 0.254: IC4.38 53.72,40.64 55.24,39.12 65.66,39.12 66.29,39.75 IC5.30 78.49,39.75 79.12,40.39 IC6.30
  Bottom 0.254: IC1.60 51.24,36.89 53.72,39.37 IC4.38
A13
  Top 0.254: IC4.37 51.18,40.64 53.21,38.61 66.17,38.61 66.67,39.12 78.87,39.12 79.5,39.75 IC5.3 90.42,39.75 91.06,40.39 IC6.3
  Bottom 0.254: IC1.58 49.64,38.84 51.18,40.39 IC4.37
A14
  Top 0.254: IC4.36 49.66,42.93 76.84,42.93 77.47,43.56 IC5.6 90.42,43.56 91.06,44.2 IC6.6
  Bottom 0.254: IC1.56 48.04,35.65 47.62,36.07 47.62,39.62 48.64,40.64 IC4.36
A15
  Top 0.254: IC4.35 47.75,43.56 IC5.27 76.45,43.56 77.09,44.2 IC6.27
  Bottom 0.254: IC1.53 45.64,41.19 46.1,41.66 IC4.35
A16
  Top 0.254: IC4.34 45.85,44.2 76.07,44.2 76.71,44.83 IC5.7 90.42,44.83 91.06,45.47 IC6.7
  Bottom 0.254: IC1.51 44.07,40.39 43.53,40.92 43.53,41.88 IC4.34
A17  (via drill 0.61)
  Top 0.254: IC6.26 76.33,45.47 75.69,44.83 IC5.26 64.77,44.83 v64.52,45.09 44.2,45.09 IC4.33
  Bottom 0.254: IC1.71 60.21,26.17 65.79,31.75 65.79,43.81 v64.52,45.09
A18  (via drill 0.61)
  Top 0.254: v61.34,50.8 64.39,50.8 64.64,50.55 71.75,50.55 72.39,51.18 IC5.12 86.36,51.18 87,51.82 IC6.12
  Bottom 0.254: IC4.2 v61.34,50.8 67.06,45.09 67.06,31.62 60.01,24.57 IC1.73
A19
  Bottom 0.254: IC4.1 63.88,51.82 67.69,48.01 67.69,30.99 60.48,23.77 IC1.74
A20  (via drill 0.61)
  Top 0.254: v63.88,32.26 v68.71,32.26
  Bottom 0.254: IC4.42 v63.88,32.26 | IC1.75 60.95,22.97 68.71,30.73 v68.71,32.26
AA0  (via drill 0.61)
  Top 0.254: CN1.28 52.45,12.19 v55.5,15.24
  Bottom 0.254: v55.5,15.24 55.17,15.24 IC1.1
AA1  (via drill 0.61)
  Top 0.254: v65.15,10.92 66.93,10.92 67.44,11.43 84.2,11.43 93.09,20.32 IC2.9
  Bottom 0.254: v65.15,10.92 65.15,10.16 64.14,9.14 53.72,9.14 52.45,7.87 CN1.27
AA2
  Top 0.254: CN1.30 49.91,12.7 53.72,16.51 71.5,16.51 75.31,20.32 IC2.2
AA3  (via drill 0.61)
  Top 0.254: v61.59,10.16 66.04,14.61 74.42,14.61 80.14,20.32 87.5,20.32 88.01,20.83 IC2.7
  Bottom 0.254: v61.59,10.16 50.93,10.16 49.91,9.14 CN1.29
AA4
  Top 0.254: CN1.32 47.37,12.7 51.82,17.14 70.1,17.14 71.5,18.54 71.5,24.13 72.77,25.4 82.93,25.4 IC2.6
AA5  (via drill 0.61)
  Top 0.254: v61.47,11.94 64.77,15.24 73.79,15.24 79.88,21.34 82.42,21.34 82.93,21.84 IC2.5
  Bottom 0.254: v61.47,11.94 58.8,11.94 58.04,11.18 49.15,11.18 47.37,9.4 CN1.31
AA6
  Top 0.254: IC2.1 74.68,24.77 75.31,24.77 76.58,23.5 76.58,19.3 73.15,15.88 63.25,15.88 60.07,12.7 CN1.22
AA7  (via drill 0.61)
  Top 0.254: v66.67,12.19 83.95,12.19 90.55,18.8 IC2.8
  Bottom 0.254: CN1.21 60.07,7.62 60.83,8.38 65.41,8.38 66.67,9.65 v66.67,12.19
D0  (via drill 0.61)
  Top 0.254: CN1.34 44.83,7.62 46.1,8.89 v46.1,10.16
  Bottom 0.254: IC1.10 47.24,13.96 47.24,11.3 v46.1,10.16
D1
  Bottom 0.254: CN1.33 44.83,10.16 46.44,11.77 IC1.11
D2  (via drill 0.61)
  Top 0.254: CN1.36 42.29,7.62 43.56,8.89 v43.56,10.16
  Bottom 0.254: IC1.12 45.64,12.24 v43.56,10.16
D3
  Bottom 0.254: CN1.35 42.29,10.16 44.84,12.71 IC1.13
D4  (via drill 0.61)
  Top 0.254: CN1.38 39.75,7.62 41.02,8.89 v41.02,10.16
  Bottom 0.254: IC1.14 44.04,13.18 v41.02,10.16
D5
  Bottom 0.254: CN1.37 39.75,10.16 43.24,13.65 IC1.15
D6  (via drill 0.61)
  Top 0.254: CN1.40 37.21,7.62 38.48,8.89 v38.48,10.16
  Bottom 0.254: IC1.16 42.44,14.12 v38.48,10.16
D7
  Bottom 0.254: CN1.39 37.21,10.16 41.64,14.59 IC1.17
GND  (via drill 0.61)
  Top 0.254: IC6.16 94.62,56.9 v94.36,57.15 | IC5.16 79.5,56.26 v79.12,56.64 | 24.51,34.67 IC3.9 | C4.2 v17.91,28.19 17.91,26.99 C5.2
  Top 0.406: 24.51,15.24 22.73,13.46 12.57,13.46 11.62,14.41 R15.1 11.62,14.92 10.54,16 10.54,19.05 v10.8,19.3
  Top 0.61: IC3.2 33.09,26.87 33.4,27.18 33.4,28.96 32.95,29.41 IC3.4 30.15,29.41 29.84,29.72 v29.84,32 | IC3.9 28.07,34.49 28.27,34.49 30.29,36.51 C7.2 | C6.2 22.55,27.75 23.24,28.45 23.24,30.23 23.7,30.68 IC3.12 25.98,30.68 27.05,31.75 v27.05,32.77 | IC7.11 v15.62,15.24 | IC8.11 8.26,30.48 9.27,31.5 v9.27,31.75
  Top 1.27: IC2.17 80.39,27.94 79.12,26.67 70.74,26.67 69.72,25.65 69.72,22.35 68.2,22.35 v67.69,21.84 67.44,21.59 66.17,21.59 v52.45,21.59 52.77,21.91 C25.2 51.46,24.93 C26.- v49.91,27.69 42.8,27.69 v42.55,27.43 41.78,26.67 C21.- 41,24.43 C16.2 40.26,23.11 41.27,22.1 41.27,18.54 v40.77,18.03 38.99,19.81 35.94,19.81 v35.18,20.57 33.91,21.84 33.91,26.67 33.4,27.18 | C3.2 v1.4,25.4 | C2.2 v1.65,38.1 | v34.67,10.16 34.67,11.94 32.64,13.97 25.78,13.97 24.51,15.24 | C6.2 21.46,27.18 21.21,26.92 v21.21,25.4 | v27.05,32.77 27.05,33.47 28.07,34.49 | IC4.32 38.48,39.37 40.26,37.59 40.26,32 40.77,31.5 v42.29,31.5
  Bottom 0.406: IC1.37 41.4,28.57 v42.55,27.43 | IC1.65 53.2,30.97 v49.91,27.69 | IC1.78 53.47,20.57 v52.45,21.59 | IC1.18 40.84,17.96 v40.77,18.03 | IC4.31 35.94,45.97 29.59,52.32 29.59,57.91 30.1,58.42 34.67,58.42 IC4.12
  Bottom 1.27: CN1.41 v34.67,10.16 32.13,10.16 CN1.43 | IC4.32 IC4.31 | v94.36,57.15 79.63,57.15 v79.12,56.64 79.12,41.84 77.85,40.57 | IC2.10 IC2.11 IC2.12 IC2.13 IC2.14 | IC2.14 88.01,31.75 86.74,33.02 81.66,33.02 80.39,31.75 IC2.17 | C22.- 6.63,29.03 C20.2 2.57,28.86 1.4,27.69 v1.4,25.4 9.27,25.4 10.8,23.88 v10.8,19.3 11.56,18.54 C19.2 13.66,15.94 14.35,15.24 v15.62,15.24 | C24.2 77.85,40.57 | 77.85,40.57 81.34,40.57 82.36,41.59 85.47,41.59 | R9.2 4.19,50.22 J1.1 | R7.2 4.19,51.38 J1.1 | C17.2 13.08,49.53 11.81,50.8 J1.1 | C18.2 85.47,41.59 | v29.84,32 C13.2 29.08,31.18 C1.1 27.3,32.51 v27.05,32.77 24.79,32.77 C8.- | C23.2 69.79,26.99 68.01,25.21 C14.2 | v9.27,31.75 7.65,31.75 C22.- | C22.- 6.63,35.66 | 6.63,35.66 4.19,38.1 v1.65,38.1 1.65,49.84 2.62,50.8 J1.1 | 6.63,35.66 7.03,36.07 15.11,36.07 17.91,33.27 v17.91,28.19 20.7,25.4 v21.21,25.4 | IC2.14 88.01,32.26 91.57,35.81 91.57,42.42 89.79,44.2 88.08,44.2 85.47,41.59 | v42.55,27.43 42.55,31.24 v42.29,31.5 | C15.2 68.01,21.53 v67.69,21.84
  other vias: 27.05,17.78 32.13,17.78 49.91,31.5 56.26,33.02 46.1,22.86 38.99,13.72 21.97,17.78 24.51,10.16 9.27,38.1 14.35,50.8 21.97,48.26 27.05,48.26 32.13,48.26 77.85,13.97 82.93,10.16 21.21,36.83 10.8,25.4
  pour Bottom (rank 2, no thermals): 0.13,58.67 0.13,22.1 10.03,22.1 10.03,13.21 22.23,13.21 22.23,7.87 87.76,7.87 87.76,13.21 99.95,13.21 99.95,58.67
  pour Top (no thermals): 0.13,58.67 0.13,22.1 10.03,22.1 10.03,13.21 22.23,13.21 22.23,8.13 87.76,8.13 87.76,13.21 99.95,13.21 99.95,58.67
MD0
  Top 0.254: IC4.14 30.86,56.52 31.24,56.13 67.06,56.13 67.18,56.26 IC5.17 69.72,56.26 71.12,57.66 83.19,57.66 83.95,56.9 IC6.17
  Bottom 0.254: IC1.49 42.44,38.71 39.75,41.15 39.75,44.45 30.86,53.34 IC4.14
MD1
  Top 0.254: IC4.16 25.78,56.52 26.8,55.5 66.8,55.5 67.31,54.99 IC5.18 69.85,54.99 70.48,55.63 IC6.18
  Bottom 0.254: IC1.47 40.84,37.01 37.85,40.01 30.23,40.01 29.59,40.64 29.59,49.53 25.78,53.34 IC4.16
MD2
  Top 0.254: IC4.18 20.7,55.88 21.72,54.86 66.42,54.86 66.93,54.36 70.23,54.36 70.87,54.99 IC5.15 90.42,54.99 91.06,55.63 IC6.15
  Bottom 0.254: IC1.44 38.44,36.87 36.58,38.73 26.42,38.73 24.51,40.64 24.51,49.53 20.7,53.34 IC4.18
MD3
  Top 0.254: IC4.20 18.54,54.23 66.04,54.23 66.55,53.72 IC5.19 70.48,53.72 71.12,54.36 IC6.19
  Bottom 0.254: IC1.42 36.84,35.93 35.31,37.47 25.15,37.47 22.73,39.88 20.7,39.88 19.43,41.15 19.43,50.16 15.62,53.98 IC4.20
MD4
  Top 0.254: IC4.23 15.62,51.69 17.53,53.59 65.66,53.59 66.17,53.09 70.74,53.09 71.37,53.72 IC5.14 90.55,53.72 91.19,54.36 IC6.14
  Bottom 0.254: IC1.41 36.04,35.46 34.67,36.83 24.51,36.83 22.48,38.86 20.7,38.86 18.92,40.64 16.89,40.64 IC4.23
MD5
  Top 0.254: IC4.25 20.7,51.05 22.61,52.96 65.28,52.96 65.79,52.45 IC5.20 70.99,52.45 71.63,53.09 IC6.20
  Bottom 0.254: IC1.43 37.64,36.4 35.94,38.1 25.78,38.1 23.24,40.64 21.97,40.64 IC4.25
MD6
  Top 0.254: IC4.27 25.78,49.78 28.32,52.32 64.9,52.32 65.41,51.82 71.25,51.82 71.88,52.45 IC5.13 90.55,52.45 91.19,53.09 IC6.13
  Bottom 0.254: IC1.46 40.04,36.54 37.21,39.37 27.05,39.37 25.78,40.64 IC4.27
MD7
  Top 0.254: IC4.29 30.86,49.53 33.02,51.69 64.52,51.69 65.02,51.18 IC5.21 71.5,51.18 72.14,51.82 IC6.21
  Bottom 0.254: IC1.48 41.64,37.48 38.48,40.64 31.5,40.64 30.86,41.27 IC4.29
N$2
  Top 0.254: IC8.5 13.59,31.75 14.1,31.24 14.1,30.23 14.79,29.53 R12.2 15.37,26.99 C5.1
N$4
  Top 1.27: CN1.44 32.13,10.16 29.59,10.16 CN1.46
N$5
  Top 0.254: IC7.12 16.89,15.56 R14.1 17.4,14.73 16.89,14.22 14.35,14.22 13.84,14.73 R15.2 14.35,15.56 IC7.10
N$6
  Top 0.254: IC7.8 11.81,16.26 12.06,16 12.83,16 13.08,16.26 IC7.9
N$7
  Top 0.254: IC7.13 18.16,16.26 18.41,16 19.18,16 19.43,16.26 IC7.14
N$11
  Bottom 0.254: IC1.3 52.84,17.28 53.59,18.03 55.24,18.03 56.77,16.51 71.5,16.51 74.04,19.05 74.04,24.13 75.31,25.4 IC2.19
N$12
  Bottom 0.254: IC2.18 76.58,31.75 74.68,31.75 74.04,31.11 74.04,26.42 71.5,23.88 71.5,18.41 70.23,17.14 57.28,17.14 55.75,18.67 52.96,18.67 52.04,17.75 IC1.4
N$13
  Bottom 0.254: IC1.2 53.64,17.06 53.98,17.4 54.86,17.4 56.39,15.88 73.15,15.88 76.58,19.3 76.58,24.13 77.85,25.4 80.39,25.4 82.93,27.94 IC2.16
N$15  (via drill 0.61)
  Top 0.254: IC7.5 14.35,20.07 15.11,19.3 19.94,19.3 24.51,23.88 24.51,25.4 IC3.16 25.98,25.6 v26.29,25.91
  Bottom 0.254: C1.2 27.3,26.92 v26.29,25.91
N$16
  Top 0.254: IC7.2 18.16,21.08 18.41,20.83 19.18,20.83 19.43,21.08 IC7.1 20.51,22.41 22.48,24.38 22.48,26.67 23.95,28.14 IC3.14
N$17
  Top 0.254: IC3.11 23.8,31.95 21.78,33.97 R1.1
N$18
  Top 0.254: IC8.12 8.76,29.21 9.27,28.7 9.27,25.4 10.29,24.38 19.18,24.38 20.19,25.4 20.19,29.46 20.38,29.65 C6.1 R1.2
N$19
  Top 0.254: IC8.13 8.51,27.94 8.76,27.69 8.76,26.92 8.51,26.67 IC8.14 6.98,26.48 6.98,25.15 5.71,23.88 1.14,23.88 0.38,24.64 0.38,27.43 0.7,27.75 R3.1
N$20
  Top 0.254: C2.1 1.65,32.32 R4.1 1.65,31.68 R3.2
N$21
  Top 0.254: C11.1 4.19,32.32 R4.2 4.19,31.68 R5.1
N$22
  Top 0.254: IC8.10 5.97,31.75 5.46,31.24 5.46,28.45 4.77,27.75 R5.2 4.89,27.06 C3.1
N$23
  Top 0.254: C11.2 4.84,36.18 | IC8.9 5.97,33.02 5.71,33.27 5.71,34.04 5.97,34.29 | IC8.8 5.97,34.29 | 3.96,40.16 C9.+ C11.2 | C11.2 5.27,36.26 5.97,35.56 5.97,34.29
N$24
  Bottom 0.254: 9.25,43.18 C10.- 8.74,43.16 7.05,41.47 R8.2
N$25
  Top 0.254: 1.65,43.18 R6.2 1.65,45.72 6.73,50.8 6.73,54.61 7.92,55.8 J1.2
  Bottom 0.254: 4.7,55.84 4.42,55.56 R7.1 8.37,55.56 J1.2
N$26
  Top 0.254: C7.1 R2.2 25.71,38.17 25.27,38.61 20.45,38.61 19.43,37.59 19.43,25.91 18.67,25.15 14.86,25.15 14.1,25.91 14.1,28.96 13.84,29.21 IC8.3
N$27
  Top 0.254: IC8.2 11.05,27.94 | 11.05,27.94 10.8,27.69 10.8,26.92 11.05,26.67 IC8.1 | R10.1 17.91,39.37 17.4,39.88 14.6,39.88 10.8,36.07 10.8,31.75 9.52,30.48 9.52,29.46 11.05,27.94
N$28
  Top 0.254: C4.1 17.91,33.72 R11.1 17.91,34.36 R10.2
N$29
  Top 0.254: R12.1 15.37,33.72 R11.2 15.37,34.36 C12.1
N$31  (via drill 0.61)
  Top 0.254: C12.2 14.54,38.54 v13.59,37.59 13.59,34.8 13.08,34.29 IC8.7 13.59,34.29 13.84,34.04 13.84,33.27 13.59,33.02 IC8.6
  Bottom 0.254: C10.+ 11.79,40.16 13.59,38.35 v13.59,37.59
N$32
  Top 0.254: R6.1 1.97,41.47 3.43,42.93 3.96,42.93 C9.-
N$33
  Bottom 0.254: R9.1 4.19,45.84 4.23,45.8 7.62,45.8 | R8.1 6.73,44.91 7.62,45.8 | 7.62,45.8 7.75,45.8 J1.5
N$34
  Top 0.254: IC3.10 23.8,33.22 22.99,34.04 22.99,36.07 23.82,36.9 R2.1
N$35  (via drill 0.61)
  Top 0.254: IC7.3 16.89,21.08 17.65,20.32 19.69,20.32 23.24,23.88 23.24,26.16 23.95,26.87 IC3.15 25.98,26.87 v26.29,27.18
  Bottom 0.254: C8.+ 24.77,28.7 v26.29,27.18
N$36
  Top 0.254: IC7.7 11.81,21.08 12.06,20.83 12.83,20.83 13.08,21.08 IC7.6 13.08,19.56 13.84,18.8 20.7,18.8 27.3,25.4 27.3,28.7 26.6,29.41 IC3.13
N$37  (via drill 0.61)
  Top 0.254: v39.75,21.08 36.45,21.08 35.18,22.35 35.18,30.23 34.73,30.68 IC3.5
  Bottom 0.254: IC1.20 39.24,20.57 v39.75,21.08
N$38  (via drill 0.61)
  Top 0.254: v35.94,31.5 35.18,31.5 34.62,31.95 IC3.6
  Bottom 0.254: IC1.45 39.24,32.51 38.73,32 36.2,32 v35.94,31.5
N$39  (via drill 0.61)
  Top 0.254: v38.23,18.29 37.72,18.8 34.92,18.8 28.83,24.89 28.83,32.51 29.54,33.22 IC3.7
  Bottom 0.254: IC1.21 38.44,18.08 v38.23,18.29
N$40  (via drill 0.61)
  Top 0.254: IC3.8 29.54,34.49 28.07,33.02 28.07,24.64 34.46,18.25 36.23,18.25 v36.7,17.78
  Bottom 0.254: IC1.24 36.04,17.12 v36.7,17.78
N$41
  Bottom 0.254: IC1.77 60.29,21.37 61.15,20.51 R13.2 63.57,19.56 Q1.2 C15.1
N$42
  Bottom 0.254: C14.1 Q1.1 64.14,24.38 62.61,22.86 R13.1 62.37,22.17 IC1.76
N$53
  Top 0.254: 45.71,19.51 45.36,18.91
VCC  (via drill 0.61)
  Top 0.254: IC6.32 87.76,37.85 v88.01,38.1 | IC5.32 71.12,37.21 v71.5,36.83
  Top 0.61: IC3.1 30.41,25.6 29.84,26.16 v29.84,26.92 29.84,27.43 30.55,28.14 IC3.3
  Top 1.27: C16.1 37.78,23.3 v36.45,24.64 38,26.19 C21.+ | C26.+ 55.24,26.9 v55.24,25.4 | C25.1 55.27,24.22 55.27,25.37 v55.24,25.4 | v55.24,25.4 60.07,25.4 61.34,26.67 67.69,26.67 71.5,30.48 IC2.20
  Bottom 0.254: 55.27,25.37 v55.24,25.4
  Bottom 0.406: IC1.55 47.24,32.14 47.37,32 | IC1.8 48.84,17.58 48.64,17.78 | IC1.32 34.99,24.57 | IC1.72 55.27,25.37
  Bottom 1.27: CN1.47 27.05,10.16 28.07,10.16 | 28.07,10.16 29.59,10.16 CN1.45 | 72.77,36.83 v71.5,36.83 71.25,37.08 C24.1 | 72.77,36.83 86.74,36.83 v88.01,38.1 C18.1 | 23.24,23.11 23.24,25.65 21.21,27.69 21.21,33.53 13.08,41.66 IC4.22 C17.1 | 23.24,23.11 23.24,19.05 28.07,14.22 28.07,11.18 | 72.77,36.83 IC2.20 72.26,29.97 C23.1 | 23.24,23.11 24.51,24.38 28.57,24.38 29.84,25.65 v29.84,26.92 C13.1 | 48.64,17.78 48.64,24.13 47.37,25.4 | v36.45,24.64 46.61,24.64 47.37,25.4 | 28.07,11.18 28.07,10.16 | 47.37,32 47.37,25.4 | 28.07,11.18 37.21,20.32 37.21,23.88 v36.45,24.64 | 34.99,24.57 36.38,24.57 v36.45,24.64 | v55.24,25.4 47.37,25.4
  pour Bottom: 26.8,14.73 26.8,8.64 30.1,8.64 30.1,12.45 33.66,16.26 25.53,16.26

### Text on the board
Top: MSX Wozblaster | c | i | o
Bottom: G.I 2012 V1.0 | ARGENTINA
tPlace: MSX - OPL4 - FM & Wave Table | Synthesizer Sound Cartridge
bPlace: Up to 2x8Mbit SRAM | MSX - Wozblaster V1.0 Rev.2 | Non commercial project | http://www.gr8bit.ru | Redesign 2013 by Eugeny Brychkov